# EAGLE design Schematic_Sensing_Module (EAGLE 9.6.2)
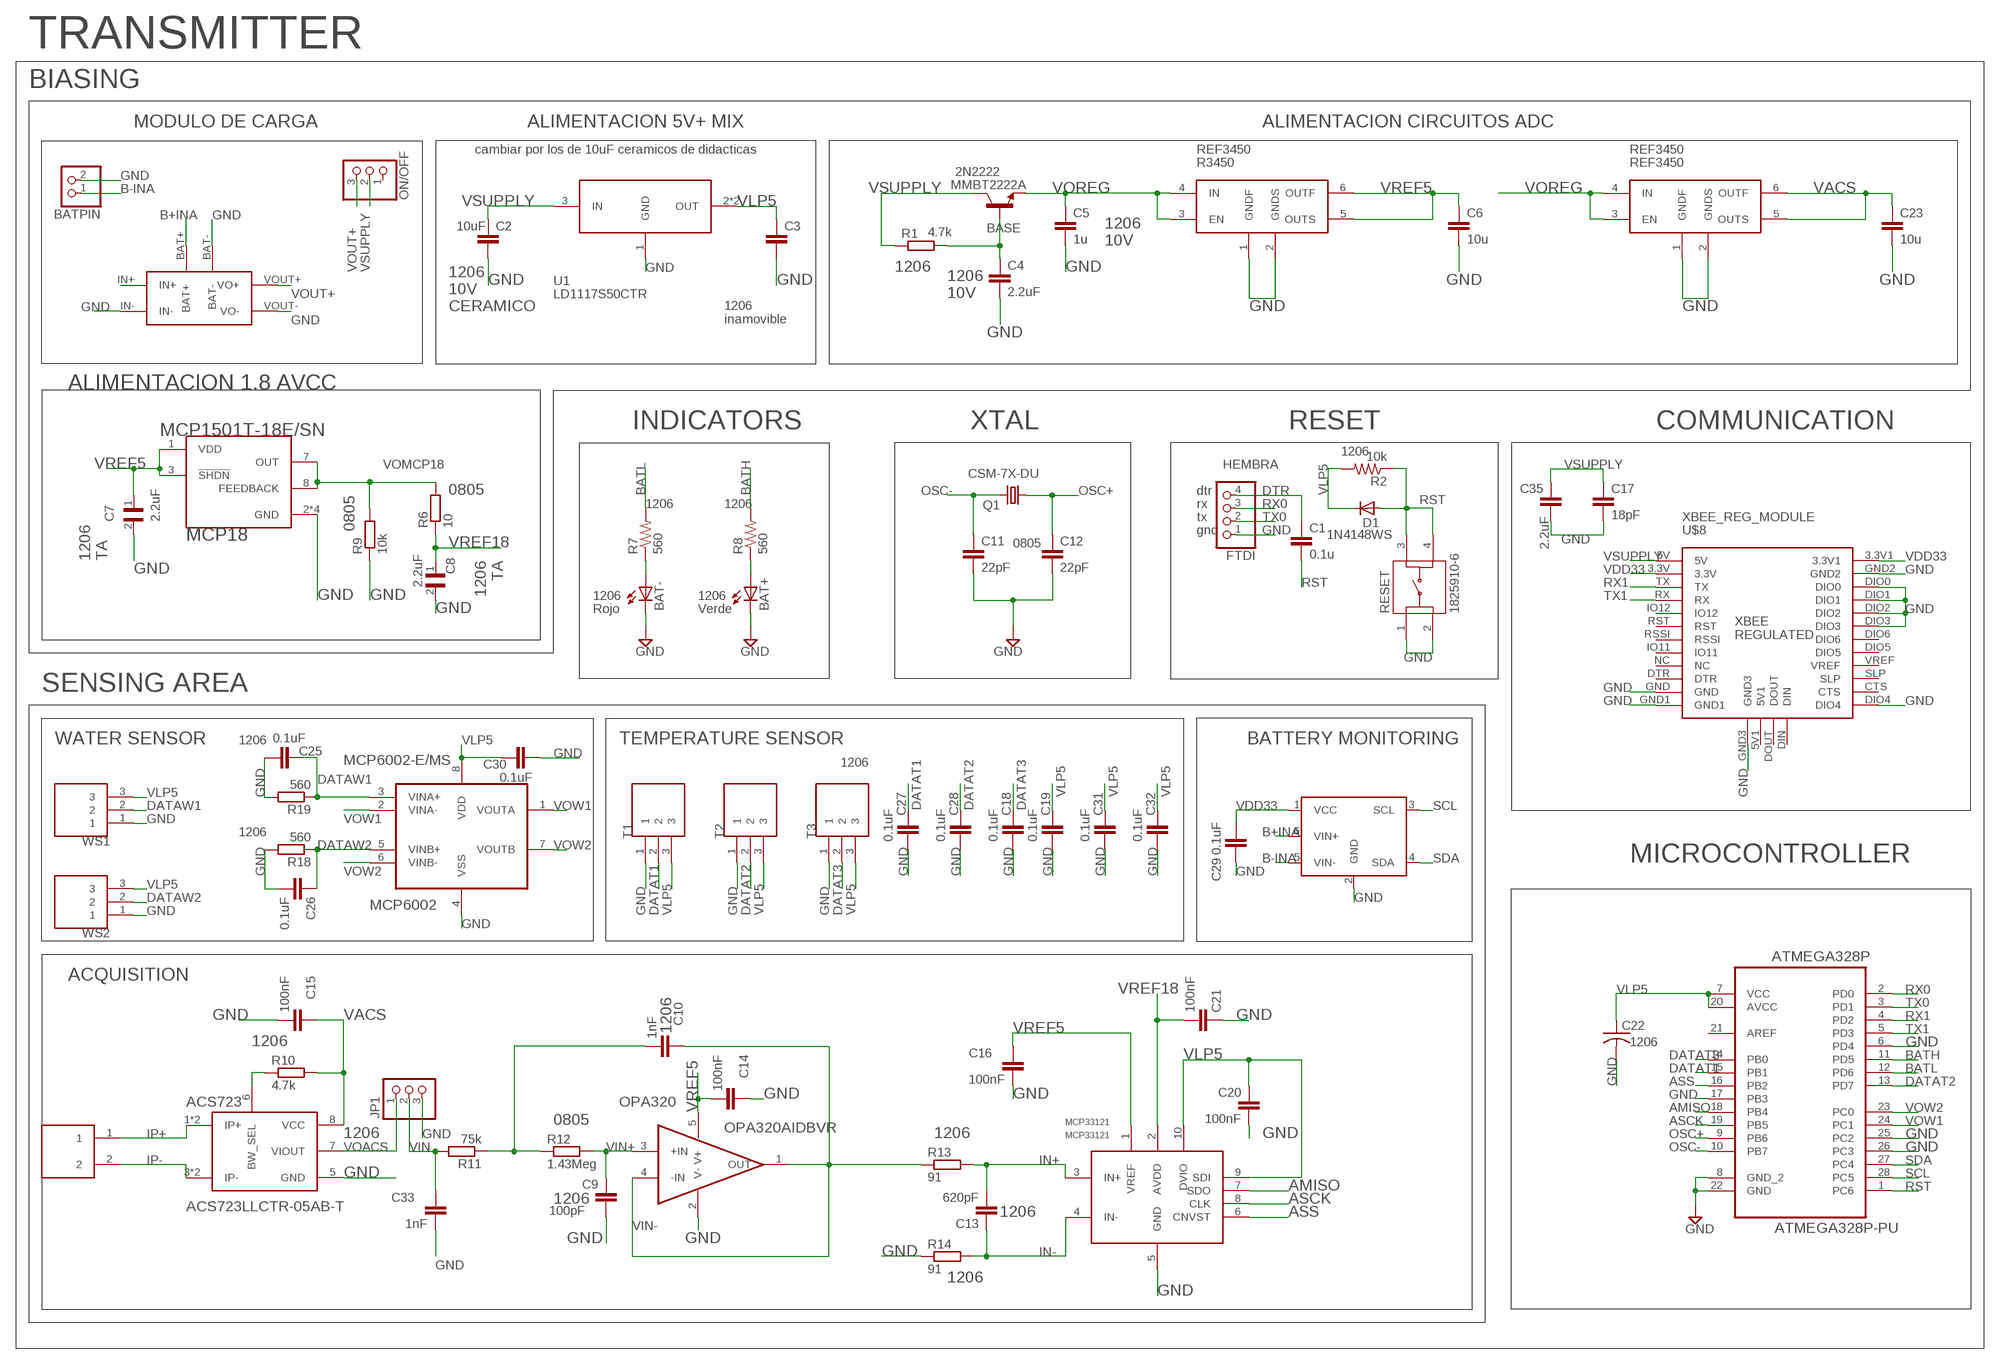
[diagram p0: schematic, sheet 1]

## Parts
2N2222  MMBT2222A  [SOT23]
ACS723  ACS723LLCTR-05AB-T  [SOIC127P600X175-8N]
ATMEGA328P  ATMEGA328P-PU  [DIP254P762X457-28]
BAT+  LEDCHIPLED_1206  [CHIPLED_1206]
BAT-  LEDCHIPLED_1206  [CHIPLED_1206]
BATPIN  PINHD-1X2  [1X02]
C1  0.1u  C-EUC0805  [C0805]
C2  10uF  C-EUC1206  [C1206]
C3  10uF  C-EUC1206  [C1206]
C4  2.2uF  C-EUC1206  [C1206]
C5  1u  C-EUC1206  [C1206]
C6  10u  C-EUC1206  [C1206]
C7  2.2uF  T491A106K010AT7280  [CAPC3216X110N]
C8  2.2uF  T491A106K010AT7280  [CAPC3216X110N]
C9  100pF  C-EUC1206  [C1206]
C10  1nF  C-EUC1206  [C1206]
C11  22pF  C-EUC0805  [C0805]
C12  22pF  C-EUC0805  [C0805]
C13  620pF  C-EUC1206  [C1206]
C14  100nF  C-EUC1206  [C1206]
C15  100nF  C-EUC1206  [C1206]
C16  100nF  C-EUC1206  [C1206]
C17  18pF  C-EUC0805  [C0805]
C18  0.1uF  C-EUC1206  [C1206]
C19  0.1uF  C-EUC1206  [C1206]
C20  100nF  C-EUC1206  [C1206]
C21  100nF  C-EUC1206  [C1206]
C22  0.1uF  C-USC1206  [C1206]
C23  10u  C-EUC1206  [C1206]
C25  0.1uF  C-EUC1206  [C1206]
C26  0.1uF  C-EUC1206  [C1206]
C27  0.1uF  C-EUC1206  [C1206]
C28  0.1uF  C-EUC1206  [C1206]
C29  0.1uF  C-EUC1206  [C1206]
C30  0.1uF  C-EUC1206  [C1206]
C31  0.1uF  C-EUC1206  [C1206]
C32  0.1uF  C-EUC1206  [C1206]
C33  1nF  C-EUC1206  [C1206]
C35  2.2uF  C-EUC1206  [C1206]
D1  1N4148WS  [SOD323]
FTDI  PINHD-1X4  [1X04]
IACT  TERMINAL-TB2  [TERMINAL-TB2]
INA219  INABB  [INA219-MODULE]
JP1  PINHD-1X3  [1X03]
MCP18  MCP1501T-18E/SN  [SOIC127P600X175-8N]
MCP6002  MCP6002-E/MS  [SOP65P490X110-8N]
MCP33121  MCP33121  [MSOP10]
ON/OFF  PINHD-1X3  [1X03]
OPA320  OPA320AIDBVR  [SOT95P280X145-5N]
POWER-SUPP  MODULO_CARGA_DEVICE  [MODULO_CARGA]
Q1  CSM-7X-DU  [CSM-7X-DU]
R1  4.7k  R-EU_R1206  [R1206]
R2  10k  R-US_R1206  [R1206]
R6  10  R-EU_R0805  [R0805]
R7  560  R-US_R1206  [R1206]
R8  560  R-US_R1206  [R1206]
R9  10k  R-EU_R0805  [R0805]
R10  4.7k  R-EU_M1206  [M1206]
R11  75k  R-EU_R1206  [R1206]
R12  1.43Meg  R-EU_R0805  [R0805]
R13  91  R-EU_R1206  [R1206]
R14  91  R-EU_R1206  [R1206]
R18  560  R-EU_R1206  [R1206]
R19  560  R-EU_R1206  [R1206]
R3450  REF3450  [SOT95P280X145-6N]
REF3450  REF3450  [SOT95P280X145-6N]
RESET  1825910-6  [SW_1825910-6-4]
T1  TERMINAL-TB3  [TERMINAL-TB3]
T2  TERMINAL-TB3  [TERMINAL-TB3]
T3  TERMINAL-TB3  [TERMINAL-TB3]
U1  LD1117S50CTR  [SOT223]
U$8  XBEE_REG_MODULE  [XBEE_REG]
WS1  TERMINAL-TB3  [TERMINAL-TB3]
WS2  TERMINAL-TB3  [TERMINAL-TB3]

## Nets
AMISO: ATMEGA328P.18(PB4) MCP33121.7(SDO)
ASCK: ATMEGA328P.19(PB5) MCP33121.8(CLK)
ASS: ATMEGA328P.16(PB2) MCP33121.6(CNVST)
B+INA: INA219.6(VIN+) POWER-SUPP.BAT+
B-INA: BATPIN.1 INA219.5(VIN-)
BASE: 2N2222.1(B) C4.1 R1.2
BATH: ATMEGA328P.11(PD5) R8.2
BATL: ATMEGA328P.12(PD6) R7.2
BWSEL: ACS723.6(BW_SEL) R10.1
DATAT1: ATMEGA328P.15(PB1) C27.1 T1.2
DATAT2: ATMEGA328P.13(PD7) C28.1 T2.2
DATAT3: ATMEGA328P.14(PB0) C18.1 T3.2
DATAW1: C25.1 MCP6002.3(VINA+) R19.1 WS1.2
DATAW2: C26.1 MCP6002.5(VINB+) R18.1 WS2.2
DTR: C1.1 FTDI.4
GND [gnd]: ACS723.5(GND) ATMEGA328P.6(PD4) ATMEGA328P.8(GND_2) ATMEGA328P.17(PB3) ATMEGA328P.22(GND) ATMEGA328P.25(PC2) ATMEGA328P.26(PC3) BAT+.C BAT-.C BATPIN.2 C2.2 C3.2 C4.2 C5.2 C6.2 C7.2 C8.2 C9.2 C11.2 C12.2 C14.1 C15.2 C16.2 C17.2 C18.2 C19.2 C20.2 C21.1 C22.2 C23.2 C25.2 C26.2 C27.2 C28.2 C29.2 C30.2 C31.2 C32.2 C33.2 C35.2 FTDI.1 INA219.2(GND) JP1.3 MCP18.2(GND) MCP18.4(GND) MCP18.5(GND) MCP18.6(GND) MCP6002.4(VSS) MCP33121.5(GND) OPA320.2(V-) POWER-SUPP.BAT- POWER-SUPP.IN- POWER-SUPP.VOUT-(VO-) R9.1 R14.1 R18.2 R19.2 R3450.1(GNDF) R3450.2(GNDS) REF3450.1(GNDF) REF3450.2(GNDS) RESET.1 RESET.2 T1.1 T2.1 T3.1 U1.1(GND) U$8.DIO0 U$8.DIO1 U$8.DIO2 U$8.DIO3 U$8.DIO4 U$8.GND U$8.GND1 U$8.GND2 U$8.GND3 WS1.1 WS2.1
IN+: C13.2 MCP33121.3(IN+) R13.2
IN-: C13.1 MCP33121.4(IN-) R14.2
IP+: ACS723.1(IP+) ACS723.2(IP+) IACT.1
IP-: ACS723.3(IP-) ACS723.4(IP-) IACT.2
N$3: BAT-.A R7.1
N$4: BAT+.A R8.1
N$14: C10.2 R11.1 R12.1
OSC+: ATMEGA328P.9(PB6) C12.1 Q1.1
OSC-: ATMEGA328P.10(PB7) C11.1 Q1.2
RST: ATMEGA328P.1(PC6) C1.2 D1.A R2.1 RESET.3 RESET.4
RX0: ATMEGA328P.2(PD0) FTDI.3
RX1: ATMEGA328P.4(PD2) U$8.TX
SCL: ATMEGA328P.28(PC5) INA219.3(SCL)
SDA: ATMEGA328P.27(PC4) INA219.4(SDA)
TX0: ATMEGA328P.3(PD1) FTDI.2
TX1: ATMEGA328P.5(PD3) U$8.RX
VACS: ACS723.8(VCC) C15.1 C23.1 R10.2 REF3450.5(OUTS) REF3450.6(OUTF)
VDD33: C29.1 INA219.1(VCC) U$8.3.3V U$8.3.3V1
VIN: C33.1 JP1.2 R11.2
VIN+: C9.1 OPA320.3(+IN) R12.2
VIN-: C10.1 OPA320.1(OUT) OPA320.4(-IN) R13.1
VLP5: ATMEGA328P.7(VCC) ATMEGA328P.20(AVCC) C3.1 C19.1 C20.1 C22.1 C30.1 C31.1 C32.1 D1.C MCP6002.8(VDD) MCP33121.9(SDI) MCP33121.10(DVIO) R2.2 T1.3 T2.3 T3.3 U1.2(OUT) U1.4(OUT) WS1.3 WS2.3
VOACS: ACS723.7(VIOUT) JP1.1
VOMCP18: MCP18.7(OUT) MCP18.8(FEEDBACK) R6.2 R9.2
VOREG: 2N2222.2(E) C5.1 R3450.3(EN) R3450.4(IN) REF3450.3(EN) REF3450.4(IN)
VOUT+: ON/OFF.3 POWER-SUPP.VOUT+(VO+)
VOW1: ATMEGA328P.24(PC1) MCP6002.1(VOUTA) MCP6002.2(VINA-)
VOW2: ATMEGA328P.23(PC0) MCP6002.6(VINB-) MCP6002.7(VOUTB)
VREF5: C6.1 C7.1 C14.2 C16.1 MCP18.1(VDD) MCP18.3(!SHDN) MCP33121.1(VREF) OPA320.5(V+) R3450.5(OUTS) R3450.6(OUTF)
VREF18: C8.1 C21.2 MCP33121.2(AVDD) R6.1
VSUPPLY: 2N2222.3(C) C2.1 C17.1 C35.1 ON/OFF.2 R1.1 U1.3(IN) U$8.5V
Unconnected: ATMEGA328P.21(AREF) ON/OFF.1 POWER-SUPP.IN+ U$8.5V1 U$8.CTS U$8.DIN U$8.DIO5 U$8.DIO6 U$8.DOUT U$8.DTR U$8.IO11 U$8.IO12 U$8.NC U$8.RSSI U$8.RST U$8.SLP U$8.VREF

## Notes on the sheet
- TRANSMITTER
- BIASING
- MODULO DE CARGA | ALIMENTACION 5V+ MIX | ALIMENTACION CIRCUITOS ADC
- cambiar por los de 10uF ceramicos de didacticas
- 1206 
  10V
- 1206
- 1206 
  10V
- 1206 
  10V
  CERAMICO
- 1206
  inamovible
- ALIMENTACION 1.8 AVCC
- INDICATORS | XTAL | RESET | COMMUNICATION
- 1206
- HEMBRA
- 0805 | 0805 | dtr
- 1206 | 1206 | rx
- tx
- gnd
- 0805
- 1206
  TA
- 1206
  TA
- 1206 | 1206
- Rojo | Verde
- SENSING AREA
- WATER SENSOR | 1206 | TEMPERATURE SENSOR | BATTERY MONITORING
- 1206
- 1206
- MICROCONTROLLER
- ACQUISITION
- 1206
- 1206 | 1206
- 0805
- 1206 | 1206
- 1206
- 1206
- 1206

## Library data of the parts
2N2222 = MMBT2222A:MMBT2222A: 2N2222 General Purpose NPN Transistor Check prices <https://pricing.snapeda.com/parts/MMBT2222A/ON%20Semiconductor/view-part?ref=eda>; AVAILABILITY: Good; DESCRIPTION: Bipolar (BJT) Transistor NPN 40V 600mA 300MHz 225mW Surface Mount SOT-23; MF: ON Semiconductor; MP: MMBT2222A; PACKAGE: None; PRICE: None
ACS723 = ACS723LLCTR-05AB-T:ACS723LLCTR-05AB-T: High Accuracy, Galvanically Isolated Current Sensor IC With Small Footprint SOIC8 Package Check prices <https://pricing.snapeda.com/parts/ACS723LLCTR-05AB-T/ALPS/view-part?ref=eda>; AVAILABILITY: Warning; DESCRIPTION: Current Sensor 5A 1 Channel Hall Effect, Open Loop Bidirectional 8-SOIC (0.154, 3.90mm Width); MF: ALPS; MP: ACS723LLCTR-05AB-T; PACKAGE: SOIC-8 Allegro MicroSystems; PRICE: None; PURCHASE-URL: https://pricing.snapeda.com/search/part/ACS723LLCTR-05AB-T/?ref=eda
ATMEGA328P = Atmel_By_element14_Batch_1-00:ATMEGA328P-PU: 8-bit Microcontroller with In-System Programmable Flash; MPN: ATMEGA328P-PU; OC_FARNELL: 1715487; OC_NEWARK: 15R0268; PACKAGE: PDIP-28; SUPPLIER: Atmel
BAT+ BAT- = led:LED: LED OSRAM: - CHIPLED LG R971, LG N971, LY N971, LG Q971, LY Q971, LO R971, LY R971 LH N974, LH R974 LS Q976, LO Q976, LY Q976 LO Q996 - Hyper CHIPLED LW Q18S LB Q993, LB Q99A, LB R99A - SideLED LS A670, LO A670, LY A670, LG A670, LP A670 LB A673, LV A673, LT A673, LW A673 LH A674 LY A675 LS A676, LA A676, LO A676, LY A676, LW A676 LS A679, LY A679, LG A679 - Hyper Micro SIDELED® LS Y876, LA Y876, LO Y876, LY Y876 LT Y87S - SmartLED LW L88C, LW L88S LB L89C, LB L89S, LG L890 LS L89K, LO L89K, LY L89K LS L896, LA L896, LO L896, LY L896 - TOPLED LS T670, LO T670, LY T670, LG T670, LP T670 LSG T670, LSP T670, LSY T670, LOP T670, LYG T670 LG T671, LOG T671, LSG T671 LB T673, LV T673, LT T673, LW T673 LH T674 LS T676, LA T676, LO T676, LY T676, LB T676, LH T676, LSB T676, LW T676 LB T67C, LV T67C, LT T67C, LS T67K, LO T67K, LY T67K, LW E67C LS E67B, LA E67B, LO E67B, LY E67B, LB E67C, LV E67C, LT E67C LW T67C LS T679, LY T679, LG T679 LS T770, LO T770, LY T770, LG T770, LP T770 LB T773, LV T773, LT T773, LW T773 LH T774 LS E675, LA E675, LY E675, LS T675 LS T776, LA T776, LO T776, LY T776, LB T776 LHGB T686 LT T68C, LB T68C - Hyper Mini TOPLED® LB M676 - Mini TOPLED Santana® LG M470 LS M47K, LO M47K, LY M47K Source: http://www.osram.convergy.de LUXEON: - LUMILED® LXK2-PW12-R00, LXK2-PW12-S00, LXK2-PW14-U00, LXK2-PW14-V00 LXK2-PM12-R00, LXK2-PM12-S00, LXK2-PM14-U00 LXK2-PE12-Q00, LXK2-PE12-R00, LXK2-PE12-S00, LXK2-PE14-T00, LXK2-PE14-U00 LXK2-PB12-K00, LXK2-PB12-L00, LXK2-PB12-M00, LXK2-PB14-N00, LXK2-PB14-P00, LXK2-PB14-Q00 LXK2-PR12-L00, LXK2-PR12-M00, LXK2-PR14-Q00, LXK2-PR14-R00 LXK2-PD12-Q00, LXK2-PD12-R00, LXK2-PD12-S00 LXK2-PH12-R00, LXK2-PH12-S00 LXK2-PL12-P00, LXK2-PL12-Q00, LXK2-PL12-R00 Source: www.luxeon.com KINGBRIGHT: KA-3528ASYC Source: www.kingbright.com
BATPIN = pinhead:PINHD-1X2: PIN HEADER
C1 C17 = rcl:C-EU: CAPACITOR, European symbol
C2-C6 C9-C16 C18-C21 C23 C25-C33 C35 = rcl:C-EU: CAPACITOR, European symbol; SPICEPREFIX: C
C7 C8 = T491A106K010AT7280:T491A106K010AT7280: CAP TANT 10UF 10V 10% 1206; DESCRIPTION: 10µF Molded Tantalum Capacitors 10V 1206 (3216 Metric) 3.8Ohm; DIGI-KEY_PART_NUMBER: 399-8268-2-ND; MF: KEMET; MP: T491A106K010AT7280; PACKAGE: 1206 Kemet; PURCHASE-URL: https://pricing.snapeda.com/search/part/T491A106K010AT7280/?ref=eda
C22 = rcl:C-US: CAPACITOR, American symbol
D1 = 1N4148WS:1N4148WS: http://octopart.com/1n4148ws-fairchild+semiconductor-7851016; AVAILABILITY: Unavailable; DESCRIPTION: Diode Switching 75V 0.3A 2-Pin SOD-323 T/R; MF: ON Semiconductor; MP: 1N4148WS; PACKAGE: S-0 Good-Ark; PRICE: None
FTDI = pinhead:PINHD-1X4: PIN HEADER
IACT = TERMINAL-TB001:TERMINAL-TB2
INA219 = INA219BB:INABB
JP1 ON/OFF = pinhead:PINHD-1X3: PIN HEADER
MCP18 = MCP1501T-18E_SN:MCP1501T-18E/SN: High Precision Buffered Voltage Reference; AVAILABILITY: Unavailable; DESCRIPTION: Series Voltage Reference IC ±0.1% 8-SOIC; MF: Microchip; MP: MCP1501T-18E/SN; PACKAGE: SOIC-8 Microchip; PRICE: None
MCP6002 = MCP6002-E_MS:MCP6002-E/MS: Check prices <https://pricing.snapeda.com/parts/MCP6002-E/MS/Microchip%20Technology/view-part?ref=eda>; AVAILABILITY: Good; DESCRIPTION: IC OPAMP GP 2 CIRCUIT 8MSOP; MF: Microchip Technology; MP: MCP6002-E/MS; PACKAGE: MSOP-8 Microchip; PRICE: None; PURCHASE-URL: https://pricing.snapeda.com/search/part/MCP6002-E/MS/?ref=eda
MCP33121 = mcp33121:MCP33121
OPA320 = OPA320AIDBVR:OPA320AIDBVR; DESCRIPTION: Precision, Zero-Crossover, 20MHz, 0.9pA Ib, RRIO, CMOS Operational Amplifier 5-SOT-23 -40 to 125; DIGI-KEY_PART_NUMBER: 296-29480-1-ND; MF: Texas Instruments; MP: OPA320AIDBVR; PACKAGE: SOT-23-5 Texas Instruments; PURCHASE-URL: https://pricing.snapeda.com/search/part/OPA320AIDBVR/?ref=eda
POWER-SUPP = Modulo_Carga:MODULO_CARGA_DEVICE
Q1 = crystal:CSM-7X-DU: SMD CRYSTAL Source: www.ecsxtal.com .. Crystal 3.6864MHz CSM_7X_DU.PDF; OC_FARNELL: unknown; OC_NEWARK: unknown
R1 R6 R9-R14 R18 R19 = rcl:R-EU_: RESISTOR, European symbol; SPICEPREFIX: R
R2 R7 R8 = rcl:R-US_: RESISTOR, American symbol
R3450 REF3450 = SOT95P280X145-6N:REF3450
RESET = button1825910-6:1825910-6: Switch Tactile OFF (ON) SPST Round Button PC Pins 0.05A 24VDC 100000Cycles 1.57N Thru-Hole Loose; AVAILABILITY: Unavailable; COMMENT: 1825910-6; CONFIGURATION_POLE-THROW: Single Pole - Single Throw; CONTACT_CURRENT_RATING: 50 mA; DESCRIPTION: Switch Push Button OFF _ON_ SPST Round Button 0.05A 24VDC Momentary Contact PC Pins Thru-Hole; EU_ROHS_COMPLIANCE: Compliant; MF: TE Connectivity; MP: 1825910-6; PACKAGE: None; PRICE: None; TE_PURCHASE_URL: https://www.te.com/usa-en/product-1825910-6.html?te_bu=Cor&te_type=disp&te_campaign=seda_glo_cor-seda-global-disp-prtnr-fy19-seda-model-bom-cta_sma-317_1&elqCampaignId=32493
T1-T3 WS1 WS2 = TERMINAL-TB001:TERMINAL-TB3: Check prices <https://pricing.snapeda.com/parts/TB001-500-03BE/CUI%20Devices/view-part?ref=eda>; AVAILABILITY: Good; CUI_PURCHASE_URL: https://www.cuidevices.com/product/interconnect/connectors/terminal-blocks/tb001-500-series?utm_source=snapeda.com&utm_medium=referral&utm_campaign=snapedaBOM; DESCRIPTION: 2~24 Poles, Screw Type, Horizontal, 5.0 Pitch, 22~12 (AWG), Terminal Block Connector; MF: CUI Devices; MP: TB001-500-03BE; PACKAGE: None; PRICE: None; PURCHASE-URL: https://pricing.snapeda.com/search/part/TB001-500-03BE/?ref=eda
U1 = LD1117S50CTR:LD1117S50CTR: http://octopart.com/ld1117s50tr-stmicroelectronics-529395 Check prices <https://pricing.snapeda.com/parts/LD1117S50CTR/STMicroelectronics/view-part?ref=eda>; AVAILABILITY: Good; DESCRIPTION: Linear Voltage Regulator IC Positive Fixed 1 Output 800mA SOT-223; MF: STMicroelectronics; MP: LD1117S50CTR; PACKAGE: SOT-223 STMicroelectronics; PRICE: None; PURCHASE-URL: https://pricing.snapeda.com/search/part/LD1117S50CTR/?ref=eda
U$8 = XBEE_REG:XBEE_REG_MODULE

## Board
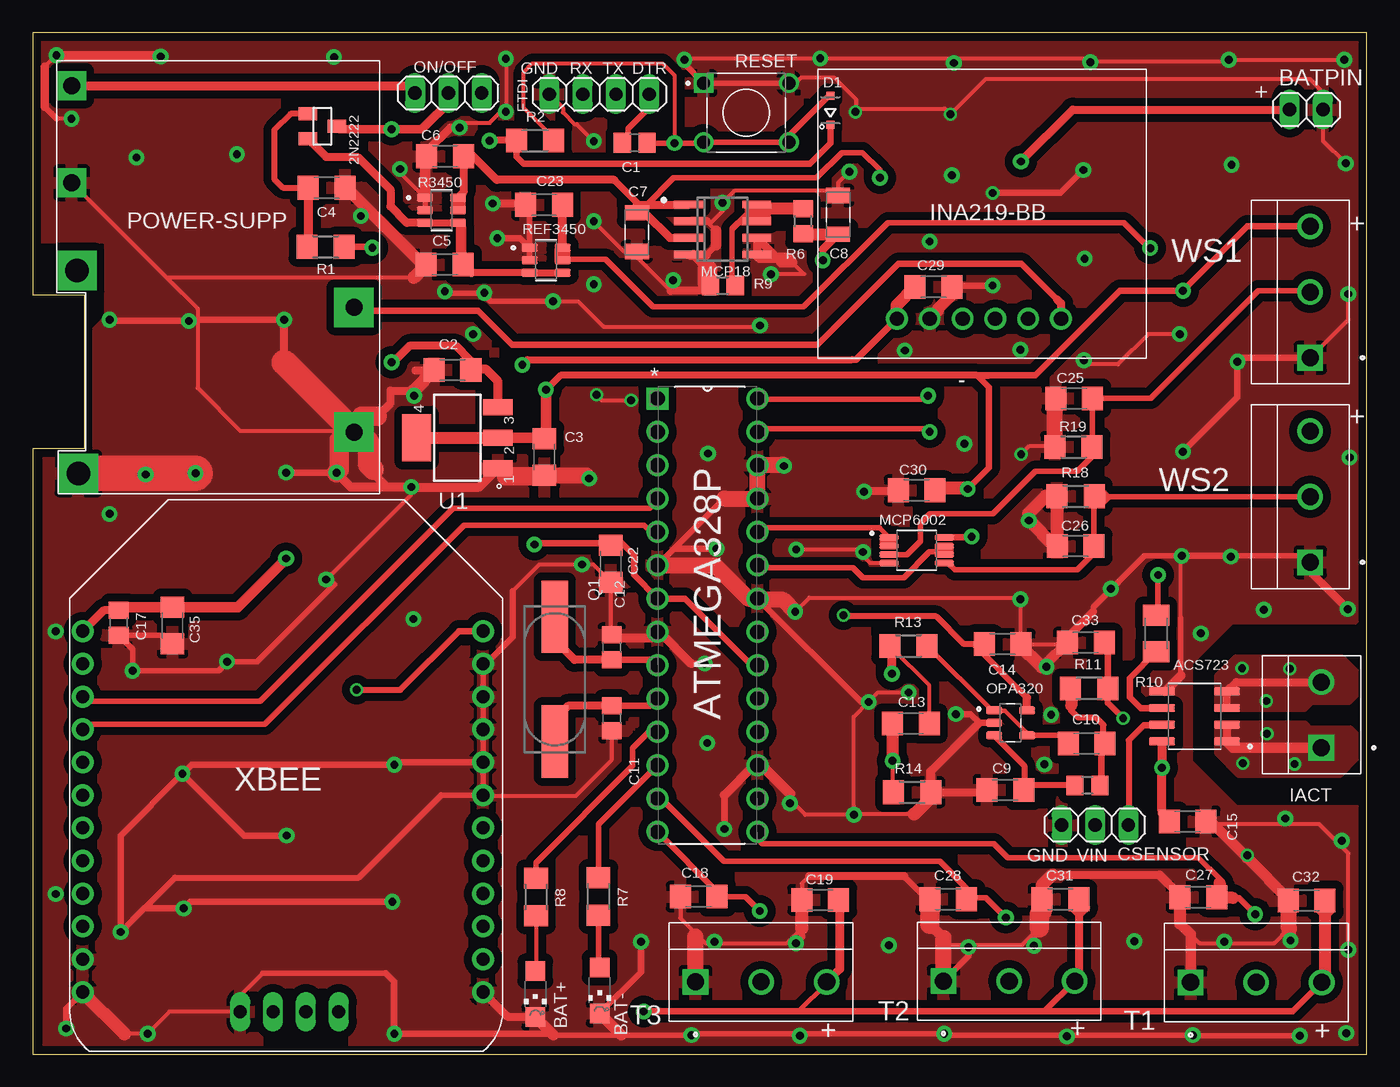
[diagram p1: board, top side]
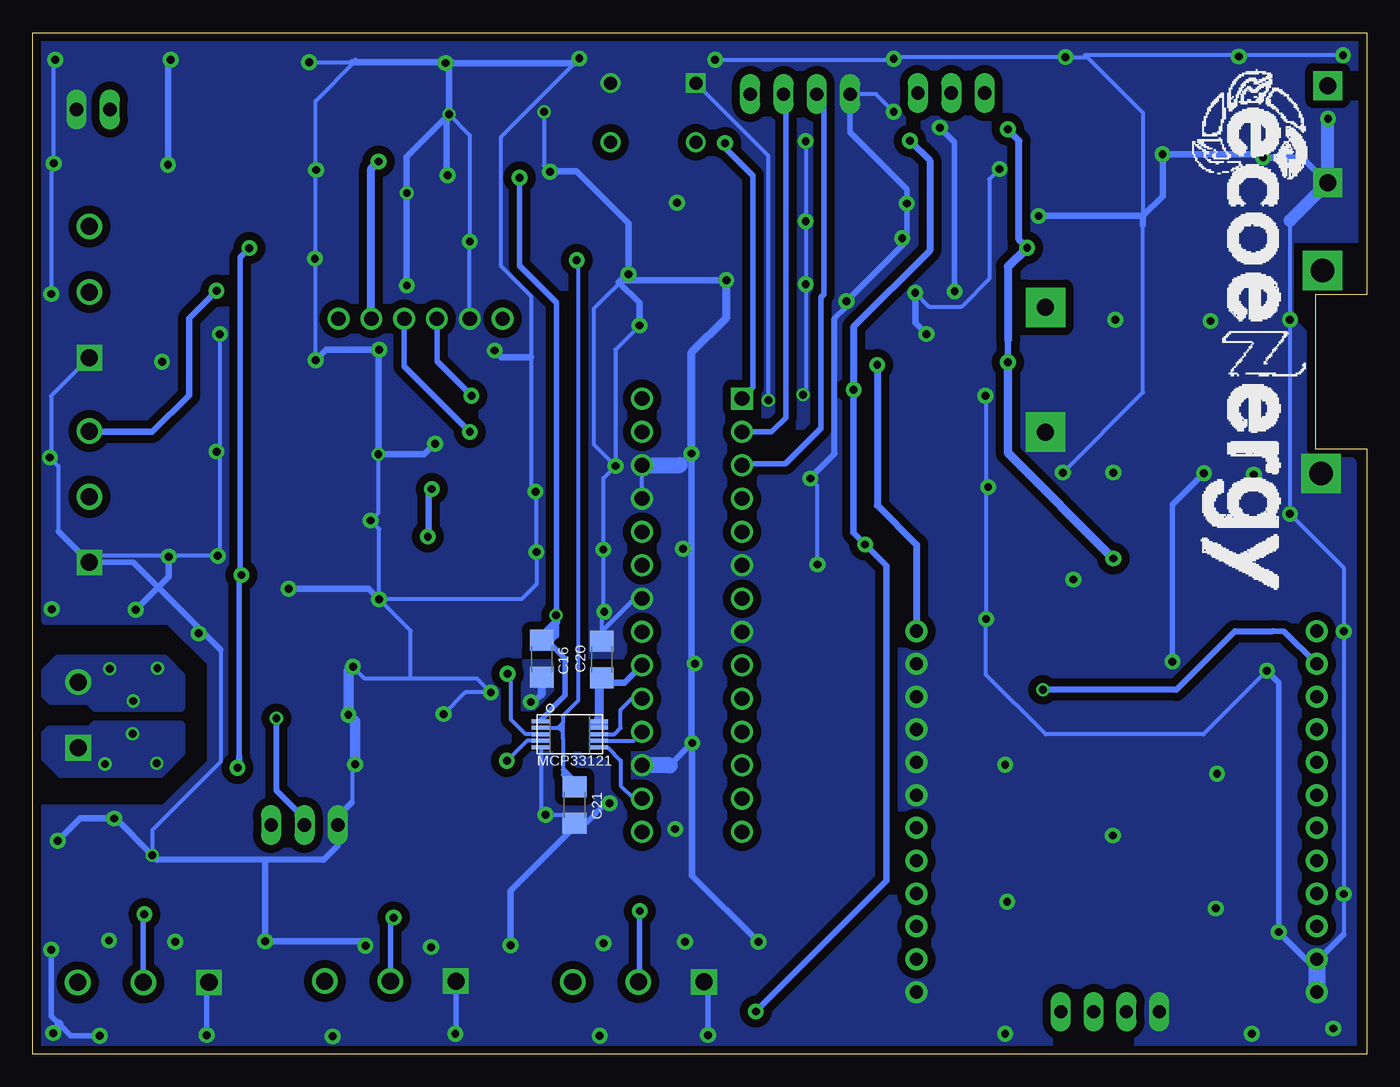
[diagram p2: board, bottom side, seen from below]

Size 101.65 x 77.8 mm. Coordinates in mm from the lower left corner, seen from the top.
Outline: 0,0 101.65,0 101.65,77.8 0,77.8 0,57.85 3.9,57.85 3.9,46.1 0,46.1 0,0
Copper layers (1*16): Top 0.035mm / dielectric 1.5mm / Bottom 0.035mm
Design rules "default *": minimum track width 0.3mm, minimum drill 0.6mm, track to track 0.6mm, track to pad 0.6mm, pad to pad 0.6mm, via to via 0.6mm, smd to smd 0.05mm, copper to edge 0.3mm, drill to drill 0.6mm, minimum pad ring 10mil, minimum via ring 8mil, stop-mask expansion 10mil, vias tented up to drill 0mil, thermal gap 0.3mm

### Footprints (pad centres in the part's own frame; a part is rotated, then mirrored left to right if it is on the bottom)
SOT23 = smd 1 x 1.4: 1 -0.95,-1.1; 2 0.95,-1.1; 3 0,1.1
SOIC127P600X175-8N = smd 1.97 x 0.6: 1 -2.475,1.905; 2 -2.475,0.635; 3 -2.475,-0.635; 4 -2.475,-1.905; 5 2.475,-1.905; 6 2.475,-0.635; 7 2.475,0.635; 8 2.475,1.905
DIP254P762X457-28 = drill 1.118 square: 1 -7.62,33.02 | drill 1.118: 2 -7.62,30.48; 3 -7.62,27.94; 4 -7.62,25.4; 5 -7.62,22.86; 6 -7.62,20.32; 7 -7.62,17.78; 8 -7.62,15.24; 9 -7.62,12.7; 10 -7.62,10.16; 11 -7.62,7.62; 12 -7.62,5.08; 13 -7.62,2.54; 14 -7.62,0; 15 0,0; 16 0,2.54; 17 0,5.08; 18 0,7.62; 19 0,10.16; 20 0,12.7; 21 0,15.24; 22 0,17.78; 23 0,20.32; 24 0,22.86; 25 0,25.4; 26 0,27.94; 27 0,30.48; 28 0,33.02
CHIPLED_1206 = smd 1.5 x 1.5: A 0,-1.75; C 0,1.75
1X02 = drill 1.016 long: 1 -1.27,0; 2 1.27,0
C0805 = smd 1.3 x 1.5: 1 -0.95,0; 2 0.95,0
C1206 = smd 1.6 x 1.8: 1 -1.4,0; 2 1.4,0
CAPC3216X110N = smd 1.16 x 1.82: 1 -1.475,0; 2 1.475,0
SOD323 = smd 0.6 x 0.6: A 1.1,0; C -1.1,0
1X04 = drill 1.016 long: 1 -3.81,0; 2 -1.27,0; 3 1.27,0; 4 3.81,0
TERMINAL-TB2 = drill 1.3 square: 1 -2.5,0 | drill 1.3: 2 2.5,0
INA219-MODULE = drill 1.1: 1 -6.5,-8; 2 -4,-8; 3 -1.5,-8; 4 1,-8; 5 3.5,-8; 6 6,-8
1X03 = drill 1.016 long: 1 -2.54,0; 2 0,0; 3 2.54,0
SOIC127P600X175-8N' = smd 2.2 x 0.6: 1 -2.6,1.905; 2 -2.6,0.635; 3 -2.6,-0.635; 4 -2.6,-1.905; 5 2.6,-1.905; 6 2.6,-0.635; 7 2.6,0.635; 8 2.6,1.905
SOP65P490X110-8N = smd 1.5 x 0.49: 1 -2.105,0.975; 2 -2.105,0.325; 3 -2.105,-0.325; 4 -2.105,-0.975; 5 2.105,-0.975; 6 2.105,-0.325; 7 2.105,0.325; 8 2.105,0.975
MSOP10 = smd 0.3 x 1.4: 1 -1,-2.2; 2 -0.5,-2.2; 3 0,-2.2; 4 0.5,-2.2; 5 1,-2.2; 6 1,2.2; 7 0.5,2.2; 8 0,2.2; 9 -0.5,2.2; 10 -1,2.2
SOT95P280X145-5N = smd 1.21 x 0.59: 1 -1.255,0.95; 2 -1.255,0; 3 -1.255,-0.95; 4 1.255,-0.95; 5 1.255,0.95
MODULO_CARGA = drill 1.3 pad 3 square: BAT+ -2.3,-10.35; BAT- -11.8,-10.35 | drill 1.8 pad 3 square: IN+ 0.5,10.75; IN- -14.95,10.65 | drill 1.3 pad 2.2 square: VOUT+ 14.6,11.15; VOUT- 7.2,11.15
CSM-7X-DU = smd 5.5 x 2: 1 -4.75,0; 2 4.75,0
R1206 = smd 1.6 x 1.803: 1 -1.422,0; 2 1.422,0
R0805 = smd 1.3 x 1.5: 1 -0.95,0; 2 0.95,0
M1206 = smd 1.6 x 2: 1 -1.4,0; 2 1.4,0
SOT95P280X145-6N = smd 1.21 x 0.58: 1 -1.255,0.95; 2 -1.255,0; 3 -1.255,-0.95; 4 1.255,-0.95; 5 1.255,0; 6 1.255,0.95
SW_1825910-6-4 = drill 0.99 square: 1 -3.25,2.25 | drill 0.99: 2 3.25,2.25; 3 -3.25,-2.25; 4 3.25,-2.25
TERMINAL-TB3 = drill 1.3 square: 1 0,-1 | drill 1.3: 2 5,-1; 3 10,-1
SOT223 = smd 2.235 x 1.219: 1 -3.099,2.311; 2 -3.099,0; 3 -3.099,-2.311 | smd 2.2 x 3.6: 4 3.099,0
XBEE_REG = drill 1 pad 1.676: 3.3V -15.5,8.5; 3.3V1 15,11; 5V -15.5,11; CTS 15,-14; DIO0 15,6; DIO1 15,3.5; DIO2 15,1; DIO3 15,-1.5; DIO4 15,-16.5; DIO5 15,-6.5; DIO6 15,-4; DTR -15.5,-11.5; GND -15.5,-14; GND1 -15.5,-16.5; GND2 15,8.5; IO11 -15.5,-6.5; IO12 -15.5,1; NC -15.5,-9; RSSI -15.5,-4; RST -15.5,-1.5; RX -15.5,3.5; SLP 15,-11.5; TX -15.5,6; VREF 15,-9 | drill 1 long: 5V1 -1,-18; DIN 4,-18; DOUT 1.5,-18; GND3 -3.5,-18

### Placement (x,y rotation side)
2N2222  22.07,70.68 270 top
ACS723  88.52,25.73 180 top
ATMEGA328P  55.22,16.92 0 top
BAT+  38.3,4.57 180 top
BAT-  43.2,4.85 180 top
BATPIN  97.05,71.95 0 top
C1  45.87,69.43 0 top
C2  31.98,52.12 180 top
C3  38.98,45.48 270 top
C4  22.39,66 0 top
C5  31.39,60.15 180 top
C6  31.42,68.4 180 top
C7  46.03,62.61 270 top
C8  61.37,63.94 90 top
C9  74.11,20.12 180 top
C10  80.3,23.65 0 top
C11  44.13,25.58 270 top
C12  44.12,30.98 90 top
C13  66.92,25.18 0 top
C14  73.9,31.23 180 top
C15  88.01,17.72 0 top
C16  62.87,30.11 270 bottom
C17  6.55,32.86 270 top
C18  50.75,12 180 top
C19  60,11.75 180 top
C20  58.28,30.06 90 bottom
C21  60.37,18.97 90 bottom
C22  44.05,37.36 270 top
C23  38.96,64.7 180 top
C25  79.36,49.95 180 top
C26  79.46,38.7 180 top
C27  88.81,11.95 180 top
C28  69.76,11.8 180 top
C29  68.64,58.45 0 top
C30  67.36,42.95 180 top
C31  78.31,11.8 180 top
C32  97.06,11.7 180 top
C33  80.24,31.35 180 top
C35  10.65,32.65 270 top
D1  60.77,71.91 90 top
FTDI  43.17,73.12 0 top
IACT  98.19,25.84 90 top
INA219  72.35,64.02 0 top
JP1  80.95,17.45 180 top
MCP18  MCP1501T-18E/SN  [SOIC127P600X175-8N']  52.57,62.82 0 top
MCP6002  67.35,38.38 0 top
MCP33121  60.73,24.37 270 bottom
ON/OFF  31.66,73.22 180 top
OPA320  74.51,25.23 0 top
POWER-SUPP  14.12,59.18 90 top
Q1  39.78,28.56 270 top
R1  22.31,61.5 180 top
R2  38.27,69.6 180 top
R6  58.7,63.44 90 top
R7  43.1,12.01 90 top
R8  38.35,11.98 90 top
R9  52.58,58.54 0 top
R10  85.6,32.04 90 top
R11  80.5,27.85 0 top
R12  80.36,20.47 180 top
R13  66.73,31.1 180 top
R14  67.01,19.95 180 top
R18  79.47,42.5 180 top
R19  79.3,46.25 180 top
R3450  31.14,64.28 0 top
REF3450  39.12,60.47 0 top
RESET  54.37,71.72 0 top
T1  88.23,6.46 0 top
T2  69.4,6.56 0 top
T3  50.5,6.5 0 top
U1  32.35,46.95 180 top
U$8  19.31,21.23 0 top
WS1  96.34,53.05 90 top
WS2  96.34,37.46 90 top

### Tracks (layer width: path | path; a pad name or v marks a point on that pad's centre or on a via)
AMISO
  Bottom 0.3: MCP33121.7 55.89,23.87 ATMEGA328P.18
ASCK
  Bottom 0.3: MCP33121.8 57.33,24.37 56.85,24.85 56.85,26.25 56.02,27.08 ATMEGA328P.19
ASS
  Bottom 0.3: ATMEGA328P.16 55.85,19.45 56.85,20.45 56.85,22.35 57.87,23.37 MCP33121.6
B+INA
  Top 0.5: 78.05,57.5 75.35,60.2 65.95,60.2 59.8,54.05 36.52,54.05 33.95,56.62 24.73,56.62 POWER-SUPP.BAT+
  Top 0.6: 78.05,57.5 78.35,57.2 INA219.6
B-INA  (via drill 0.6 pad 1.2)
  Top 0.6: v75.3,68 79.25,71.95 BATPIN.1
  Bottom 0.6: INA219.5 75.85,67.45 v75.3,68
BASE
  Top 0.45: 2N2222.1 19.63,71.63 18.4,70.4 18.4,66.65 19.05,66 C4.1
  Top 0.7: C4.1 20.99,61.6 R1.2
BATH
  Top 0.4: 47.52,24.46 ATMEGA328P.11 46.94,24.54 45.71,23.31 45.71,21.95 38.35,14.59 R8.2
BATL
  Top 0.4: ATMEGA328P.12 43.1,17.5 R7.2
BWSEL
  Top 0.508: ACS723.6 84.44,26.36 83.6,27.2 83.6,28.64 R10.1
DATAT1  (via drill 0.6 pad 1.2)
  Top 0.4: ATMEGA328P.15 55.22,16.42 55.62,16.02 73.25,16.02 74.3,14.97 88.83,14.97 90.45,13.35 90.45,13.05 | v93.15,10.65 91.9,11.9 91.45,11.9
  Top 0.9: 90.45,13.05 90.45,12.19 C27.1 90.26,11.9 91.45,11.9
  Bottom 0.4: 93.23,10.57 T1.2
  Bottom 0.45: v93.15,10.65 93.23,10.57
DATAT2  (via drill 0.6 pad 1.2)
  Top 0.4: ATMEGA328P.13 47.5,19.46 47.4,19.56 47.9,19.56 47.65,19.31 48.05,19.31 52.69,14.68 69.12,14.68 71.16,12.64 C28.1 71.26,11.9 72.65,11.9 v74.15,10.4
  Bottom 0.4: T2.2 74.4,10.15 v74.15,10.4
DATAT3  (via drill 0.6 pad 1.2)
  Top 0.4: 52.25,11.9 52.25,12.27 ATMEGA328P.14 | C18.1 54.3,12 v55.4,10.9
  Top 0.45: 52.25,11.9 C18.1
  Bottom 0.4: v55.4,10.9 55.4,5.6
  Bottom 0.45: 55.4,5.6 T3.2
DATAW1
  Top 0.4: 80.76,46.29 C25.1 85.2,49.95 93.4,58.15 97.24,58.15 WS1.2 | 81.1,45.9 79.6,44.4 76.4,44.4 73.15,41.15 68.35,41.15 67.65,40.45 67.65,39.07 66.63,38.05 MCP6002.3
  Top 0.45: R19.1 80.76,46.29 81.1,45.95 81.1,45.9
DATAW2
  Top 0.3: 82.05,42.45 81.4,43.1 81.4,41.85 81.45,41.8 82.05,42.4 82.05,42.45
  Top 0.4: C26.1 80.86,42.16 | MCP6002.5 69.75,37.41 70.26,36.9 79.6,36.9 80.9,38.2 | WS2.2 82.05,42.45 80.94,42.45 R18.1
  Top 0.45: R18.1 81.2,42.5 80.86,42.16
  Top 0.6: C26.1 80.9,38.66 80.9,38.2
DTR
  Top 0.4: C1.1 45.37,69.88 45.37,70.51 46.98,72.12 FTDI.4
GND  (via drill 0.6, 0.6 pad 1.2)
  Top 0.3: C28.2 68.25,11.69 | 24.82,47.03 POWER-SUPP.BAT- 24.4,47.45 15.85,47.45 12.55,50.75 12.55,56.8 10.2,59.15 | POWER-SUPP.VOUT- 10.2,59.15 | 29.04,59.15 10.2,59.15 | 70.04,58.01 C29.2 | 52.07,62.73 51.58,63.23 | 51.58,63.23 51.34,63.46 | R9.1 51.24,58.15 | 48.6,58.15 46.03,60.72 C7.2 45.06,61.13 v42.75,63.45 | MCP18.4 50.32,60.91 | C11.2 44.13,22.43 41.35,19.65 33.93,19.65 33.85,19.73 | ATMEGA328P.8 47.12,31.68 | C12.2 44.05,32 C22.2 42.71,37.3 v41.86,37.3 38.6,37.3 36.55,35.25 | 78.84,31.73 C33.2 78.72,31.23 C14.1 | 75.15,31.23 C14.1 | MCP6002.4 63.82,37.41 63.27,37.95 v63.27,38.25 63.08,38.44 v58.17,38.44 | v63.35,42.85 63.4,42.9 | 65.91,42.9 C30.2 | 78.05,38.71 C26.2 77.85,38.7 | R19.2 77.88,46.32 75.95,46.32 v75.31,45.69 | 77.88,49.87 C25.2 | v75.9,40.65 75.9,41.2 | 77.2,42.5 R18.2 | v32.52,70.58 32.89,70.95 34.83,70.95 35.66,71.78 v36.05,71.78 v36.05,75.82 | v23.15,44.3 23.2,44.25 23.55,43.9 | v58.1,33.7 59.17,34.77 75.12,34.77 v75.25,34.65 75.3,34.6 C14.1 | 55.32,34.6 ATMEGA328P.22 | 55.28,44.8 ATMEGA328P.26 | 57.51,60.66 57.84,60.34 58.77,59.41 v56.26,59.41 | v66.75,27.55 64.42,27.55 v63.7,26.82 62.58,25.7 v62.58,18.22 | v77.25,29.5 76.88,29.5 | 59.15,13.55 58.6,13 C19.2 | R3450.1 27.98,67.14 v27.98,67.43 | 51.58,63.23 52.58,64.23 52.58,64.55 52.58,64.85 53.52,65.79 61.27,65.79 61.65,65.42 C8.2 61.37,66.37 v62.23,67.22 | C18.2 49.35,10.35 50.62,9.08 51.25,8.45 51.9,8.45 57.48,8.45 58.6,9.58 | 68.36,9.89 69.92,8.33 75.42,8.33 76.71,9.61 | C31.2 76.91,12.86 | 87.41,9.94 88.9,8.45 91,8.45 94.6,8.45 95.72,9.58 | 95.72,11.45 95.72,11.63 C32.2 | 67.17,18.27 62.62,18.27 v62.58,18.22 | v62.58,18.22 58.88,18.22 58,19.1 v57.7,19.1
  Top 0.3: RESET.2 58.14,73.97 58.58,74.4 61.05,74.4 62.73,72.72 62.73,71.8 v62.7,71.78 62.95,72.03 69.5,72.03 v69.94,71.59 72.65,74.3 97.3,74.3 98.32,73.28 BATPIN.2 98.32,69.58 v100.05,67.85 | REF3450.2 37.87,60.61 | FTDI.1 40.39,72.1 40.39,71.74 41.28,70.85 41.45,70.85 v42.75,69.55 | v39.65,57.35 41.56,57.35 43.5,55.41 55.33,55.41 v55.42,55.5 | v87.4,54.85 85,54.85 82.7,52.55 80.4,52.55 v80.1,52.85 | 87.5,33.2 87.5,37.9 v87.55,37.95 | v100.25,7.95 100.25,15.3 98.03,17.52 89.61,17.52 | WS1.1 100.25,55.96 v100.25,57.9 | v29.05,50.15 29.05,50.55 | v99.95,75.75 v91.15,75.75 91.05,75.65 80.7,75.65 v80.6,75.55 80.3,75.85 v60,75.85 49.75,75.85 v49.65,75.75 | 17.5,6.15 15.81,4.46 U$8.GND3 10.43,3.23 v8.75,1.55 6.99,1.55 | v42.95,50.22 43.37,49.8 v45.6,49.8 | v2.95,71.25 1.84,71.25 | 0.92,75.22 v1.8,76.1 | v22.35,36.15 28.85,42.65 v28.85,43.2
  Top 0.35: R14.1 68.45,19.95 | 72.54,19.95 C9.2
  Top 0.4: ACS723.5 86.3,27.63 | 87.5,28.83 87.5,33.2 | WS2.1 96.84,37.96 92.26,37.96 92.25,37.95 v87.55,37.95 84.71,37.95 80.81,34.05 80.81,33.7 | ATMEGA328P.6 52.68,42.32 | v96.55,1.4 88.45,1.4 v88.4,1.45 78.65,1.45 69.55,1.45 v69.45,1.55 58.45,1.55 50.3,1.55 v50.2,1.45 44.84,1.45 39.67,1.45 | 26.9,6.15 17.5,6.15 | C35.2 9.99,31.91 C17.2 7.6,30.86 v7.6,29.2 14.15,29.2 14.8,29.85 v14.8,29.9 17.1,29.9 22.95,35.75 | v12.4,44.25 12.38,44.23 | 37.46,64.8 C23.2 37.87,64.4 REF3450.1 37.87,60.61 | 31.82,70.58 v32.52,70.58 | v31.4,58.1 31.55,57.95 34.28,57.95 34.88,57.35 v39.65,57.35 | 29.89,68.27 C6.2 | R3450.2 R3450.1 | 57.7,19.82 v57.7,19.1 | 87.41,12.1 C27.2 | RESET.1 RESET.2 | 31.11,19.73 33.85,19.73 U$8.DIO3 U$8.DIO2 U$8.DIO1 U$8.DIO0 34.31,29.5 U$8.GND2 | 1.84,71.25 0.92,72.17
  Top 0.45: v6.7,9.3 10.85,13.45 24.82,13.45 31.11,19.73
  Top 0.5: 51.31,60.87 52.07,61.62 | ATMEGA328P.22 63.09,26.82 v63.7,26.82 | 68.25,11.69 66.39,13.55 | 36.55,35.25 36.55,31.74 34.31,29.5 | v73.15,58.55 70.14,58.55 C29.2 | RESET.1 49.65,75.44 v49.65,75.75 | OPA320.2 72.12,25.23 72.12,25.24 71.46,25.9 v70.35,25.9 | v27.4,11.6 12,11.6 v11.5,11.1 8.5,11.1 v6.7,9.3 6.7,16.65 v11.4,21.35 | v11.4,21.35 12.1,22.05 v27.55,22.05 27.73,22.23 U$8.DIO2 | v19.35,16.65 16.1,16.65 v11.4,21.35 | v22.35,36.15 22.55,36.15 22.95,35.75 | v19.3,44.3 v23.15,44.3 | v8.6,44.15 8.68,44.23 12.38,44.23 | v19.15,55.95 12,55.95 v11.9,55.85 5.95,55.85 v5.85,55.95 | v73.15,65.6 78.3,65.6 v80.05,67.35 | 95.85,11.65 95.72,11.78 | v90.8,8.55 90.9,8.55 91,8.45 | T2.1 71.3,7.46 v71.3,8.15 | v76.3,8.25 76.3,10.24 76.71,10.65 76.91,10.85 | v78.8,1.35 78.75,1.35 78.65,1.45 | v58.15,8.45 58.6,8.9 58.6,9.58 | v51.95,8.55 51.9,8.5 51.9,8.45 | v58.45,1.4 58.45,1.55 | v52.7,17.15 52.7,19.73 | v46.35,8.55 46.35,6.25 BAT-.C | v51.2,29.75 50.16,29.75 | v52.1,38.5 48.86,38.5 ATMEGA328P.6 | v52.55,64.85 52.58,64.83 52.58,64.55 | REF3450.1 37.13,62.15 v35.4,62.15 | v91.3,37.9 91.25,37.95 v87.55,37.95 | WS1.1 92.1,53.05 v91.8,52.75 91.8,50.05 v87.65,45.9 | v2.55,1.95 2.55,3.47 U$8.GND1 | 26.9,6.15 27.55,5.5 v27.55,1.55 39.57,1.55 39.67,1.45
  Top 0.6: 68.45,19.95 68.85,19.95 72.54,19.95 | 51.34,63.46 MCP18.2 | MCP18.4 50.02,60.87 | MCP18.5 MCP18.6 55.19,62.18 57.04,60.34 | 51.24,58.15 48.6,58.15 | 78.84,31.73 80.81,33.7 | 63.4,42.9 65.91,42.9 | v35.05,64.8 37.46,64.8 | C6.2 30.02,68.78 31.82,70.58 | v57.25,44.8 57.15,44.9 | 66.39,13.55 59.15,13.55 | 77.7,13.65 85.86,13.65 | BAT+.C 36.22,2.82 U$8.DIO4 | 89.61,17.52 C15.2 | v100.2,33.9 97.34,36.76 WS2.1 | 68.43,21.53 68.43,21.54 72.12,25.23 | U1.1 35.74,44.93 | 19.15,52.7 v19.15,55.95 | 29.17,52.08 30.58,52.08 | 29.05,50.55 27.25,50.55 27.25,49.6 26.25,48.6 | 27,43.2 25.95,44.25 25.95,44.55
  Top 0.65: 0.92,72.17 0.92,75.22
  Top 0.7: 87.5,28.83 86.3,27.63 | 50.02,60.87 51.31,60.87 | 50.32,60.91 51.43,59.8 | 47.12,31.68 44.37,31.68 C12.2 | 87.41,12.1 85.86,13.65 | v92.55,15.15 92.55,14.95 | R14.1 68.43,21.53 | ATMEGA328P.17 54.97,22 52.7,19.73 | 50.16,29.75 47.75,32.16 ATMEGA328P.8 | 36.06,44.03 U1.1 34.01,43.2 v28.85,43.2 27,43.2 24.25,43.2 23.2,44.25 | v1.8,76.1 9.65,76.1 v9.75,76
  Top 0.8: C5.2 29.74,60.15 | 52.07,61.62 52.07,62.73 | R3450.1 29.89,68.27 | MCP18.5 55.42,60.66 57.51,60.66 | 78.72,31.23 77.25,29.76 v77.25,29.5 | ATMEGA328P.17 55.52,22 57.7,19.82 | v92.55,15.15 92.35,15.15 89.78,17.72 C15.2 | 55.22,44.74 55.28,44.8 55.38,44.9 | 69.4,8.85 68.36,9.89 | T1.1 88.23,9.12 87.41,9.94 | 50.5,8.95 50.62,9.08 | 57.04,60.34 57.84,60.34 | v95.85,8.65 95.85,11.65
  Top 0.85: 44.84,1.45 BAT-.C | 39.67,1.45 BAT+.C | 92.55,14.95 95.72,11.78
  Top 0.9: C5.2 29.99,60.1 | 29.74,60.15 23.89,66 | C27.2 87.41,9.94 | INA219.2 68.97,56.64 68.97,56.8 70.04,57.86 70.04,58.01 | v28.85,43.2 28.8,43.25
  Top 1: 29.99,60.1 29.04,59.15 | R18.2 78.05,38.71 | 75.9,41.2 77.2,42.5 | 77.85,38.7 v75.9,40.65 | 76.88,29.5 75.15,31.23 | 58.6,9.58 C19.2 | 76.91,12.86 77.7,13.65 | 67.17,18.27 68.85,19.95 | C2.2 30.58,52.08 29.05,50.55 | 6.99,1.55 U$8.GND1 | C3.2 38.93,44.03 | POWER-SUPP.BAT- 23.97,47.38 23.35,46.76
  Top 1.2: 51.43,58.74 R9.1 | ATMEGA328P.6 51.98,37.24 54.52,34.7 ATMEGA328P.22 | 52.68,42.32 ATMEGA328P.25 55.22,44.74 | 77.88,46.32 77.88,49.87 | v58.1,33.7 57.2,34.6 55.32,34.6 | 55.38,44.9 57.15,44.9 | 95.72,9.58 95.72,11.45 95.72,11.78 | T2.1 69.4,8.85 | T3.1 50.5,8.95 | C3.2 42.17,44.08
  Top 1.4: 38.93,44.03 36.06,44.03
  Top 1.5: 23.89,66 C4.2 | 51.43,59.8 51.43,58.74 | C28.2 68.36,9.89 | 76.71,9.61 76.71,10.65 | 76.91,10.85 C31.2 | 23.35,46.76 23.35,44.5 v23.15,44.3 | POWER-SUPP.BAT- 24.47,48.02 25.05,48.6 26.25,48.6
  Top 1.6: 25.95,44.55 25.57,44.93 25.57,46.68 24.87,47.38 POWER-SUPP.BAT-
  Top 1.9: POWER-SUPP.BAT- 19.15,52.7
  Top 2.7: 12.38,44.23 POWER-SUPP.IN-
  Bottom 0.3: INA219.2 v68.35,61.9 | 68.35,62 68.35,70 v69.94,71.59 | v75.25,34.65 75.25,40 v75.9,40.65 75.31,41.24 v75.31,45.69 | ATMEGA328P.25 ATMEGA328P.26 | v36.05,71.78 37.4,73.12 FTDI.1 | 17.05,63.85 17.05,71.7 21.3,75.95 | 17.05,63.15 17.05,50.4 v23.15,44.3 | C20.2 58.28,33.52 v58.1,33.7 58.2,33.8 58.2,38.41 v58.17,38.44 58.17,43.88 v57.25,44.8 | v41.86,37.3 41.9,37.34 41.9,43.35 v42.4,43.85 | v56.26,59.41 58.9,56.77 58.9,46.45 v57.25,44.8 | v70.35,25.9 68.7,27.55 v66.75,27.55 67.8,28.6 72.85,28.6 | 72.85,28.6 76.35,28.6 v77.25,29.5 | v77.09,22.07 77.32,21.84 77.32,19.18 | C21.1 60.48,17.67 61.02,18.22 v62.58,18.22 62.93,18.58 MCP33121.5 | v27.98,67.43 28.75,66.65 28.75,59.05 30.85,56.95 33.35,56.95 v34.41,58.01 | 87.33,30.8 87.33,22.27 92.55,17.05 v92.55,15.15 | v62.7,71.78 62.7,67.7 v62.23,67.22 | v42.75,69.55 v42.75,63.45 v42.75,58.65 42.75,50.42 v42.95,50.22 | v55.42,55.5 57.25,53.67 v57.25,44.8 | v75.25,34.65 64.4,34.65 63.27,35.77 v63.27,38.25 63.27,42.77 v63.35,42.85 63.67,43.17 63.67,53.1 63.67,57.73 65.95,60 65.95,69.9 60.15,75.7 v60,75.85 | v87.4,54.85 87.4,45.85 87.4,38.1 v87.55,37.95 91.3,37.95 97.15,37.95 97.49,37.61 | v80.6,75.55 77.3,75.55 77.25,75.55 77.05,75.75 77,75.7 80.1,72.6 80.1,60.7 v80.1,52.85 | v49.65,75.75 36.12,75.75 v36.05,75.82 36.05,75.89 35.99,75.95 v22.95,75.95 21.3,75.95 | 21.3,75.95 21.45,76.1 v1.8,76.1 1.85,76.15 | 3,71.3 v2.95,71.25 2.97,71.23 | v29.05,50.15 29,50.1 v29,33.15 29.05,33.1 29.05,28.95 24.45,24.35 12.45,24.35 v7.6,29.2 | 5.85,63.5 v5.85,55.95 v5.85,41.15 1.75,37.05 v1.75,32.2 v1.75,12.2 1.75,9.14 | v100.25,57.9 100.25,67.65 v100.05,67.85 100.05,75.65 v99.95,75.75
  Bottom 0.3: WS1.1 100.25,50.14 100.25,45.55 v100.35,45.45 99.7,44.8 99.7,39.82 | 72.85,28.6 72.85,32.25 v75.25,34.65 | v45.6,49.8 45.6,68.45 RESET.1
  Bottom 0.35: C20.2 58.28,32.22 55.8,34.7 ATMEGA328P.22
  Bottom 0.4: 99.7,39.82 97.49,37.61 WS2.1 93.98,37.46 88.94,32.41 87.33,30.8 | v100.25,7.95 100.25,2.9 99.65,2.3 98.75,1.4 v96.55,1.4 | v88.4,1.45 88.4,5.29 T1.1 | v69.45,1.55 69.4,1.6 T2.1 | v50.2,1.45 50.2,5.2 T3.1 | v6.7,9.3 6.7,28.3 v7.6,29.2 | v14.8,29.9 14.8,41.85 v12.4,44.25 | v42.4,43.85 42.4,43.9 40.55,45.75 | 40.55,56.05 39.65,56.95 v39.65,57.35 35.05,61.95 v35.05,64.8 35.05,65.9 39.37,70.22 FTDI.1 | v32.52,70.58 31.4,69.46 v31.4,58.1 | v57.7,19.1 58,19.1 59.42,17.67 60.48,17.67 | 1.75,9.14 3.66,7.23 U$8.GND
  Bottom 0.45: 40.55,45.75 40.55,56.05 | 77.32,19.18 78.41,18.09 JP1.3 78.41,15.89 79.5,14.8 83.95,14.8 92.2,14.8 v92.55,15.15
  Bottom 0.5: 62.9,28.21 62.87,28.23 C16.2 | v63.7,26.82 63.47,26.82 62.9,27.4 | U$8.GND 4.63,7.23 v6.7,9.3 | 51.45,23.75 v51.45,45.75 52.34,44.86 | 53.1,22 v51.4,23.7 51.4,13.6 v46.35,8.55 | v62.23,67.22 62.2,67.25 60.2,67.25 56.26,63.31 v56.26,59.41 56.41,59.41 56.87,58.95 | v48.8,58.95 56.87,58.95 | 56.87,58.95 57.01,58.81 55.42,57.22 v55.42,55.5 | C21.1 60.37,17.33 65.25,12.45 v65.25,8.3 | 70.11,71.41 v69.94,71.59 69.94,75.24 v70.2,75.5 | 70.11,71.41 73.15,68.38 v73.15,65.6 v73.15,58.55 | v80.1,52.85 79.3,53.65 v75.25,53.65 75.31,53.59 v75.31,45.69 71.81,45.69 v71,46.5 | v33.55,54.85 34.41,55.71 v34.41,58.01 | 83.95,14.8 v83.95,8.6 76.45,8.6 76.2,8.35 v76.3,8.25 | v25,63.85 17.05,63.85 | v66.45,53.6 65.95,53.1 63.67,53.1 | 68.35,62 v68.35,61.9 | 17.05,63.15 17.05,63.85 | 17.05,63.85 15.55,65.35 v15.55,68.55 8.15,68.55 v7.9,68.3 4.89,68.3 POWER-SUPP.VOUT- | v70.05,66.95 70.11,67.01 70.11,71.41 | 77.3,75.55 70.25,75.55 v70.2,75.5 | v70.2,75.5 60.35,75.5 60.15,75.7 | v82.15,35.45 76.05,35.45 v75.25,34.65 | v93.8,33.85 91.3,36.35 91.3,37.95 | v89,32.05 89,32.35 88.94,32.41 | v99.75,16.25 98.05,17.95 v95.45,17.95 95.35,17.95 v92.55,15.15 | v91.35,67.75 91.35,75.55 v91.15,75.75 | v87.65,45.9 87.6,45.85 87.4,45.85 | v80.15,60.6 80.1,60.65 80.1,60.7
  Bottom 0.6: 62.9,28.21 62.9,27.4 | v51.45,45.75 51.45,53.45 48.8,56.1 v48.8,58.95
  Bottom 0.7: v100.1,1.6 99.65,2.05 99.65,2.3
  Bottom 0.8: v77.09,22.07 77.09,25.34 v77.6,25.85 77.6,29.15 v77.25,29.5 | 51.45,23.75 v51.4,23.7
  Bottom 1: 2.97,71.23 POWER-SUPP.VOUT- 5.85,63.5
  Bottom 1.2: ATMEGA328P.26 52.34,44.86 | 53.1,22 ATMEGA328P.17
  Bottom 1.3: U$8.GND U$8.GND1
  pour Top (isolate 0.61, rank 2): 0.75,77 100.65,77 100.65,33.15 91.25,33.15 87.95,29.85 87.95,22.2 91.6,18.55 101.1,18.55 101.1,0.45 1.2,0.45 1.2,45.5 4.9,45.5 4.9,55.05 5.9,56.05 5.9,62.2 0.75,62.2
  pour Bottom (isolate 0.61, rank 2, no thermals): 1.15,45 1.15,0.4 101.15,0.4 101.15,18.6 91.6,18.6 88,22.2 88,29.85 91.25,33.1 100.65,33.1 100.65,77.05 0.7,77.05 0.7,62.2 5.85,62.2 5.95,62.1 5.95,55.95 4.95,54.95 4.95,45.6 4.9,45.55 1.7,45.55
IN+  (via drill 0.6 pad 1.2)
  Top 0.3: C13.2 68.32,28.09 65.47,30.93
  Top 0.45: 65.47,30.93 R13.2
  Top 0.7: v65.47,28.97 65.47,30.93
  Bottom 0.3: MCP33121.3 64.09,24.37 65.22,25.5 65.22,28.72 v65.47,28.97
IN-  (via drill 0.6 pad 1.2)
  Top 0.3: v65.52,22.35 65.52,20.02
  Top 0.35: R14.2 65.52,20.02
  Top 0.9: C13.1 v65.52,22.35
  Bottom 0.3: MCP33121.4 64,23.87 v65.52,22.35
IP+  (via drill 0.6)
  Top 0.6: ACS723.2 ACS723.1
  Top 0.8: ACS723.1 91.48,23.34 IACT.1
  other vias: 94.05,24.4 96.15,22.1 92.2,22.15
  pour Top (isolate 0.61, rank 2, no thermals): 90.5,25 96.9,25 97.25,24.65 100.35,24.65 100.75,24.25 100.75,22.65 99.55,21.45 91.95,21.45 90.4,23 90.4,24.8 90.58,24.97
  pour Bottom (isolate 0.61, rank 2, no thermals): 90.4,25 90.4,23 91.95,21.45 99.5,21.45 100.75,22.7 100.75,24.25 100.35,24.65 97.25,24.65 96.9,25
IP-  (via drill 0.6)
  Top 0.6: ACS723.3 ACS723.4 91.7,28.34 IACT.2
  other vias: 94,26.9 95.8,29.35 92.15,29.4
  pour Top (isolate 0.61, rank 2, no thermals): 90.4,26.45 96.85,26.45 97.4,27 100.25,27 100.75,27.5 100.75,29 99.7,30.05 91.7,30.05 90.4,28.75
  pour Bottom (isolate 0.61, rank 2, no thermals): 90.4,28.8 91.65,30.05 99.7,30.05 100.75,29 100.75,27.5 100.25,27 97.4,27 96.85,26.45 90.4,26.45 90.4,28.75 90.45,28.8
N$3
  Top 0.4: R7.1 43.1,6.7
  Top 0.55: 43.1,6.7 BAT-.A
N$4
  Top 0.3: BAT+.A 38.35,6.37 R8.1
N$14
  Top 0.4: 81.6,23.9 81.6,23.75 C10.2 81.42,23.38
  Top 0.45: 81.6,23.9 81.6,25.08 81.03,25.65 79.65,25.65 79.13,26.17
  Top 0.5: R12.1 81.42,20.58 81.42,23.38 | 79.13,26.17 79.13,26.55
  Top 0.9: 79.13,26.55 79.13,27.8 R11.1
OSC+
  Top 0.508: C12.1 47.19,30.03 ATMEGA328P.9
  Top 0.6: C12.1 41.27,30.03 39.78,31.52 Q1.1
OSC-
  Top 0.508: C11.1 47.05,26.53 ATMEGA328P.10
  Top 0.6: C11.1 40.78,26.53 39.78,25.53 Q1.2
RST  (via drill 0.6 pad 1.2)
  Top 0.3: R2.1 39.69,69.8 37.4,72.09 37.4,74.81 38.06,75.47 47.98,75.47 48.9,74.55 v48.9,69.4 48.85,69.4
  Top 0.4: v48.9,69.4 51.05,69.4 RESET.3 RESET.4 | C1.2 46.84,69.4 48.85,69.4
  Top 0.5: RESET.4 57.62,69.97 60.66,73.01 D1.A
  Bottom 0.4: ATMEGA328P.1 46.75,50.79 46.75,66.9 48.9,69.05 v48.9,69.4
RX0
  Bottom 0.4: ATMEGA328P.2 45.35,47.4 44.27,48.48 44.27,72.95 FTDI.3
RX1
  Top 0.4: ATMEGA328P.4 47.7,42.32 47.75,42.27 47.7,42.27 47,41.57 32.02,41.57 17.33,26.88 4.16,26.88 U$8.TX
SCL  (via drill 0.6 pad 1.2)
  Top 0.4: v68.22,50.15 68.22,49.88 55.28,49.88 ATMEGA328P.28
  Bottom 0.4: INA219.3 70.85,52.77 v68.22,50.15
SDA  (via drill 0.6 pad 1.2)
  Top 0.4: v68.35,47.4 68.1,47.65 55.47,47.65 ATMEGA328P.27
  Bottom 0.4: INA219.4 73.35,52.4 v68.35,47.4
TX0
  Bottom 0.4: FTDI.2 41.35,72.57 41.35,57.9 41.6,57.65 41.6,47.66 44.3,44.96 47.5,44.96 ATMEGA328P.3
TX1
  Top 0.4: ATMEGA328P.5 47.1,39.78 46.58,40.3 32.85,40.3 17.68,25.13 4.21,25.13 U$8.RX
VACS  (via drill 0.6 pad 1.2)
  Top 0.3: 43.65,60.55 43.64,60.56 | 40.38,60.56 REF3450.6
  Top 0.4: v85.15,61.4 85.1,61.4 83.15,63.35 65.15,63.35 58.72,56.92 47.28,56.92 43.65,60.55 | v85.75,36.5 85.75,33.59 R10.2 | 43.64,60.56 40.38,60.56
  Top 0.45: REF3450.5 REF3450.6
  Top 0.6: 40.38,64.69 C23.1 | C15.1 86.05,18.27 86.05,18.53
  Top 0.7: REF3450.6 40.38,64.69 | ACS723.8 v86.05,21.82 v86.05,21.81 86.05,18.53
  Bottom 0.4: v85.15,61.4 85.85,60.7 85.85,36.6 v85.75,36.5 85.92,36.32 85.92,22.64
  Bottom 0.5: 85.92,21.94 85.92,22.64
  Bottom 0.6: v86.05,21.81 85.92,21.94
VDD33  (via drill 0.6, 0.6 pad 1.2)
  Top 0.45: v24.68,27.75 28,27.75 32.48,32.23
  Top 0.5: 32.48,32.23 U$8.3.3V1 | 62.43,52.9 62.73,52.9
  Top 0.55: 62.43,52.9 37.7,52.9 v37.3,52.5 | 62.73,52.9 INA219.1
  Top 0.9: INA219.1 65.85,57.06 C29.1
  Bottom 0.4: 7.15,32.23 6.3,32.23 U$8.3.3V
  Bottom 0.45: 7.15,32.23 10.05,32.23 14.53,27.75 v24.68,27.75
  Bottom 0.55: v37.3,52.5 37.3,41.8 34.31,38.81 U$8.3.3V1
VIN  (via drill 0.6)
  Top 0.45: v83.09,25.59 81.92,26.76 R11.2
  Top 0.508: R11.2 81.92,31.07 C33.1
  Bottom 0.45: v83.09,25.59 83.09,20.1 80.94,17.95 JP1.2
VIN+
  Top 0.45: R12.2 75.56,20.47 | C9.1 75.56,20.07 75.56,20.47 | OPA320.3 75.56,21.97 75.56,20.47
VIN-
  Top 0.3: 75.77,24.48 74.09,26.15
  Top 0.35: 74.09,26.15 73.28,26.15 | OPA320.1 73.07,26.18 R13.1 | OPA320.4 75.77,24.48
  Top 0.4: OPA320.4 78.27,24.28 C10.1
  Top 0.45: OPA320.1 73.28,26.15
VLP5  (via drill 0.6 pad 1.2)
  Top 0.35: T3.3 60.5,5.4 58.35,3.25
  Top 0.4: C19.1 61.5,11.65 | 79.75,10.55 80.35,11.15 79.15,11.15 79.75,10.55 | 97.85,11.05 98.45,10.45 98.55,10.45 99.05,10.95 98.95,11.05 97.85,11.05
  Top 0.45: v71.25,43.05 72.85,44.65
  Top 0.5: D1.C 60.8,70.79 60.8,69.4 59.22,67.82 37.38,67.82 36.85,68.35 R2.2 | WS1.3 92.55,63.05 v87.65,58.15 82.85,58.15 76.4,51.7 72.85,51.7 | v38.23,38.82 38.3,38.9 44.19,38.9 44.9,38.9 45.8,38 45.8,36.5 ATMEGA328P.7 49.7,34.7 54.78,29.62 ATMEGA328P.20 | v46.55,3.25 58.35,3.25 77.09,3.25 | 77.09,3.25 T2.3 79.71,5.87 | 77.09,3.25 96.02,3.25 T1.3 98.46,5.69 | 71.95,51.7 72.85,50.8 72.85,44.65 | v71.55,39.42 71.5,39.37 69.47,39.37 MCP6002.8
  Top 0.55: R2.2 34.83,69.6 v34.8,69.58 | v39.1,50.6 40.2,51.7 71.95,51.7 72.85,51.7
  Top 0.6: C31.1 79.71,5.87 | T3.3 61.5,6.5
  Top 0.65: 39.1,47 C3.1 | 44.19,38.9 C22.1
  Top 0.7: 61.5,6.5 61.5,11.65 | 38.91,46.95 C3.1
  Top 0.8: v39.1,50.6 39.1,47 | U1.2 38.91,46.95
  Top 0.9: C32.1 98.46,5.69 | U1.4 U1.2
  Top 1: v71.25,43.05 71.2,43.1 68.91,43.1 C30.1
  Bottom 0.3: MCP33121.9 MCP33121.10 | 58.5,28.25 58.19,28.56
  Bottom 0.35: 57.92,28.3 58.19,28.56 C20.1
  Bottom 0.5: v87.65,58.15 89.75,56.05 89.75,50.2 92.55,47.4 97.28,47.4 WS2.3 | ATMEGA328P.20 56.54,28.3 57.92,28.3 | v46.55,3.25 36.6,13.2 36.6,37.2 v38.23,38.82 39.1,39.7 v39.1,50.6 | v71.25,43.05 71.5,42.8 71.5,39.47 v71.55,39.42 | MCP33121.10 58.53,25.56 58.5,25.59
  Bottom 0.55: v34.8,69.58 33.3,68.08 33.3,61.2 39.1,55.4 v39.1,50.6
  Bottom 0.7: 58.5,28.25 58.5,25.59
VOACS
  Top 0.45: ACS723.7 86,25.05 | JP1.1 83.53,17.49 83.53,23.92
  Top 0.5: 83.53,23.92 84.66,25.05 86,25.05
VOMCP18
  Top 0.35: 53.31,62.87 53.27,62.87
  Top 0.4: MCP18.7 55.05,63.34 53.74,63.34 53.27,62.87 53.27,58.43 53.55,58.15 | MCP18.8 53.31,62.87
  Top 0.5: 55.51,64.39 MCP18.8
  Top 0.6: MCP18.7 MCP18.8 | 53.55,58.15 53.55,58.52 R9.2 | 54.55,64.35 54.55,63.75 55.95,63.75 55.95,64.35 54.55,64.35
  Top 0.9: R6.2 55.51,64.39
VOREG
  Top 0.35: R3450.4 32.4,60.55 C5.1
  Top 0.5: C5.1 32.79,62.93 R3450.4
  Top 0.55: R3450.3 R3450.4 | REF3450.4 REF3450.3 33.42,59.52
  Top 0.6: 33.42,59.52 C5.1 | 2N2222.2 22.35,68.35 24.75,68.35 27.25,65.85 27.25,64.58 28.5,63.33 R3450.3
VOUT+
  Top 0.7: POWER-SUPP.VOUT+ 28.56,73.78
  Top 0.8: 28.56,73.78 ON/OFF.3
VOW1
  Top 0.35: MCP6002.1 64.52,40.08
  Top 0.4: 64.52,40.08 55.52,40.08 ATMEGA328P.24 | MCP6002.2 MCP6002.1
VOW2
  Top 0.4: ATMEGA328P.23 55.42,37.04 62.51,37.04 63.25,36.3 66.37,36.3 68.33,38.25 69.35,38.25 69.35,38.6 MCP6002.7
  Top 0.45: MCP6002.6 MCP6002.7
VREF5  (via drill 0.6, 0.6 pad 1.2)
  Top 0.3: 46.72,64.62 46.72,64.4 46.47,64.15 46.09,64.15 | 46.09,64.15 46.05,64.15 46.05,64.11 C7.1 | C7.1 46.62,64.09 46.62,64.11 46.62,64.29 46.3,64.6 46.3,64.36 C7.1 | C7.1 46.09,64.15
  Top 0.4: 46.72,64.62 48.84,66.74 59.73,66.74 61.66,68.68 63.23,68.68 64.55,67.35 v64.55,66.75 | C14.2 71.7,31.23 | 61.85,33.35 v61.77,33.42
  Top 0.45: 71.7,31.23 70.97,31.23 68.85,33.35 61.85,33.35 | C7.1 46.03,64.48
  Top 0.455: 75.77,27.16 71.7,31.23
  Top 0.5: 32.55,64.35 32.75,64.55 32.75,65.15 32.15,65.15 | 46.03,64.48 46.03,64.68 46.03,64.87
  Top 0.55: 46.03,64.87 44.31,66.59
  Top 0.6: R3450.5 R3450.6 32.82,65.66 C6.1 33.07,68.65 33.3,68.65 35.36,66.59 44.31,66.59 | 32.15,65.15 32.15,64.35 32.55,64.35 | MCP18.3 48.54,62.18 46.62,64.11 | OPA320.5 75.77,27.16 | MCP18.1 49.92,64.68 46.03,64.68
  Bottom 0.3: MCP33121.1 62.93,25.47
  Bottom 0.35: 62.47,31.51 62.32,31.36
  Bottom 0.4: 62.93,25.47 61.08,27.32 61.08,30.11 62.32,31.36 | v64.55,66.75 64.55,60.05 61.75,57.25 61.75,33.45 v61.77,33.42 61.77,32.91
  Bottom 0.45: v61.77,33.42 61.77,31.9 62.32,31.36 | 62.47,31.51 C16.1 62.87,31.81
  Bottom 0.6: 61.77,32.91 62.87,31.81
VREF18  (via drill 0.6 pad 1.2)
  Top 0.4: C8.1 61.35,62.45 | R6.1 59.21,62.49 59.25,62.45
  Top 0.45: 60.2,61.3 v60.2,60.48
  Top 0.6: C8.1 60.2,61.3
  Top 0.9: 59.25,62.45 61.35,62.45
  Bottom 0.3: v60.2,60.48 60.1,60.38 60.1,26.92 61.26,25.76 61.26,25.25 | 61.25,21.65 60.37,20.77 C21.2 | 61.25,21.65 61.25,21.25 60.45,20.45 | 61.26,24.55 61.26,25.25 | 61.25,21.65 61.25,24.05 61.26,24.05 61.26,24.55 | 61.26,24.55 61.58,24.87 MCP33121.2 61.63,24.87 61.26,25.25
  Bottom 0.35: 60.45,20.45 60.45,20.95 61.15,21.65 61.25,21.65
VSUPPLY  (via drill 0.6 pad 1.2)
  Top 0.5: R1.1 25.8,61.5 v25.88,61.42
  Top 0.55: v27.35,52.7 27.45,52.7
  Top 0.6: 27.45,52.7 28.7,53.95 32.25,53.95 33.38,52.82 C2.1 33.46,52.2
  Top 0.61: C17.1 5.39,33.81 U$8.5V
  Top 0.65: 2N2222.3 23.4,70.45 v27.35,70.45 29.65,70.45 31.9,72.7
  Top 0.7: U1.3 35.45,51.25 34.5,52.2 33.46,52.2
  Top 0.8: C17.1 6.79,34.05 C35.1 15.6,34.05 v19.3,37.75 | 31.9,72.7 31.9,72.98 ON/OFF.2
  Bottom 0.5: 27.32,54.42 27.32,52.73 v27.35,52.7
  Bottom 0.55: v25.88,61.42 26.5,62.05 26.5,69.58 27.35,70.43 v27.35,70.45
  Bottom 0.6: 27.32,59.98 27.32,54.42
  Bottom 0.65: v25.88,61.42 27.32,59.98 | v27.35,52.7 27.35,45.8 v19.3,37.75
(copper drawn outside any net)
  shapes: Bottom area x1, Top area x3

### Text on the board
tPlace: XBEE | GND | VIN | CSENSOR
tNames: GND | RX | TX | DTR | + | + | - | + | + | + | +